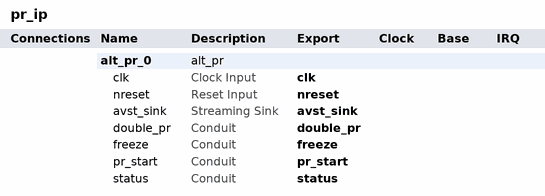
[diagram p0: system contents]
# Platform Designer (Qsys) system pr_ip, Arria 10 10AS066N3F40E2SGE2
# Parameters at their usual value, and those the tool derives, are not listed.
package require qsys
create_system pr_ip
set_project_property DEVICE_FAMILY {Arria 10}
set_project_property DEVICE 10AS066N3F40E2SGE2

add_instance alt_pr_0 alt_pr 16.0
set_instance_property alt_pr_0 AUTO_EXPORT true
set_instance_parameter_value alt_pr_0 CDRATIO 1
set_instance_parameter_value alt_pr_0 DATA_WIDTH_INDEX 16
set_instance_parameter_value alt_pr_0 EDCRC_OSC_DIVIDER 1
set_instance_parameter_value alt_pr_0 ENABLE_AVMM_SLAVE false
set_instance_parameter_value alt_pr_0 ENABLE_ENHANCED_DECOMPRESSION false
set_instance_parameter_value alt_pr_0 ENABLE_INTERRUPT false
set_instance_parameter_value alt_pr_0 ENABLE_JTAG true
set_instance_parameter_value alt_pr_0 ENABLE_PRPOF_ID_CHECK_UI false
set_instance_parameter_value alt_pr_0 EXT_HOST_PRPOF_ID 0
set_instance_parameter_value alt_pr_0 EXT_HOST_TARGET_DEVICE_FAMILY {Stratix V}
set_instance_parameter_value alt_pr_0 INSTANTIATE_CRC_BLOCK true
set_instance_parameter_value alt_pr_0 INSTANTIATE_PR_BLOCK true
set_instance_parameter_value alt_pr_0 PR_INTERNAL_HOST true

# exported interfaces
add_interface avst_sink avalon_streaming sink
set_interface_property avst_sink EXPORT_OF alt_pr_0.avst_sink
add_interface clk clock sink
set_interface_property clk EXPORT_OF alt_pr_0.clk
add_interface double_pr conduit end
set_interface_property double_pr EXPORT_OF alt_pr_0.double_pr
add_interface freeze conduit end
set_interface_property freeze EXPORT_OF alt_pr_0.freeze
add_interface nreset reset sink
set_interface_property nreset EXPORT_OF alt_pr_0.nreset
add_interface pr_start conduit end
set_interface_property pr_start EXPORT_OF alt_pr_0.pr_start
add_interface status conduit end
set_interface_property status EXPORT_OF alt_pr_0.status

set_interconnect_requirement {$system} qsys_mm.clockCrossingAdapter HANDSHAKE
set_interconnect_requirement {$system} qsys_mm.insertDefaultSlave FALSE
set_interconnect_requirement {$system} qsys_mm.maxAdditionalLatency 1

save_system pr_ip.qsys
